# EAGLE schematic hump (EAGLE 6.1)

## Sheet 1 of 2
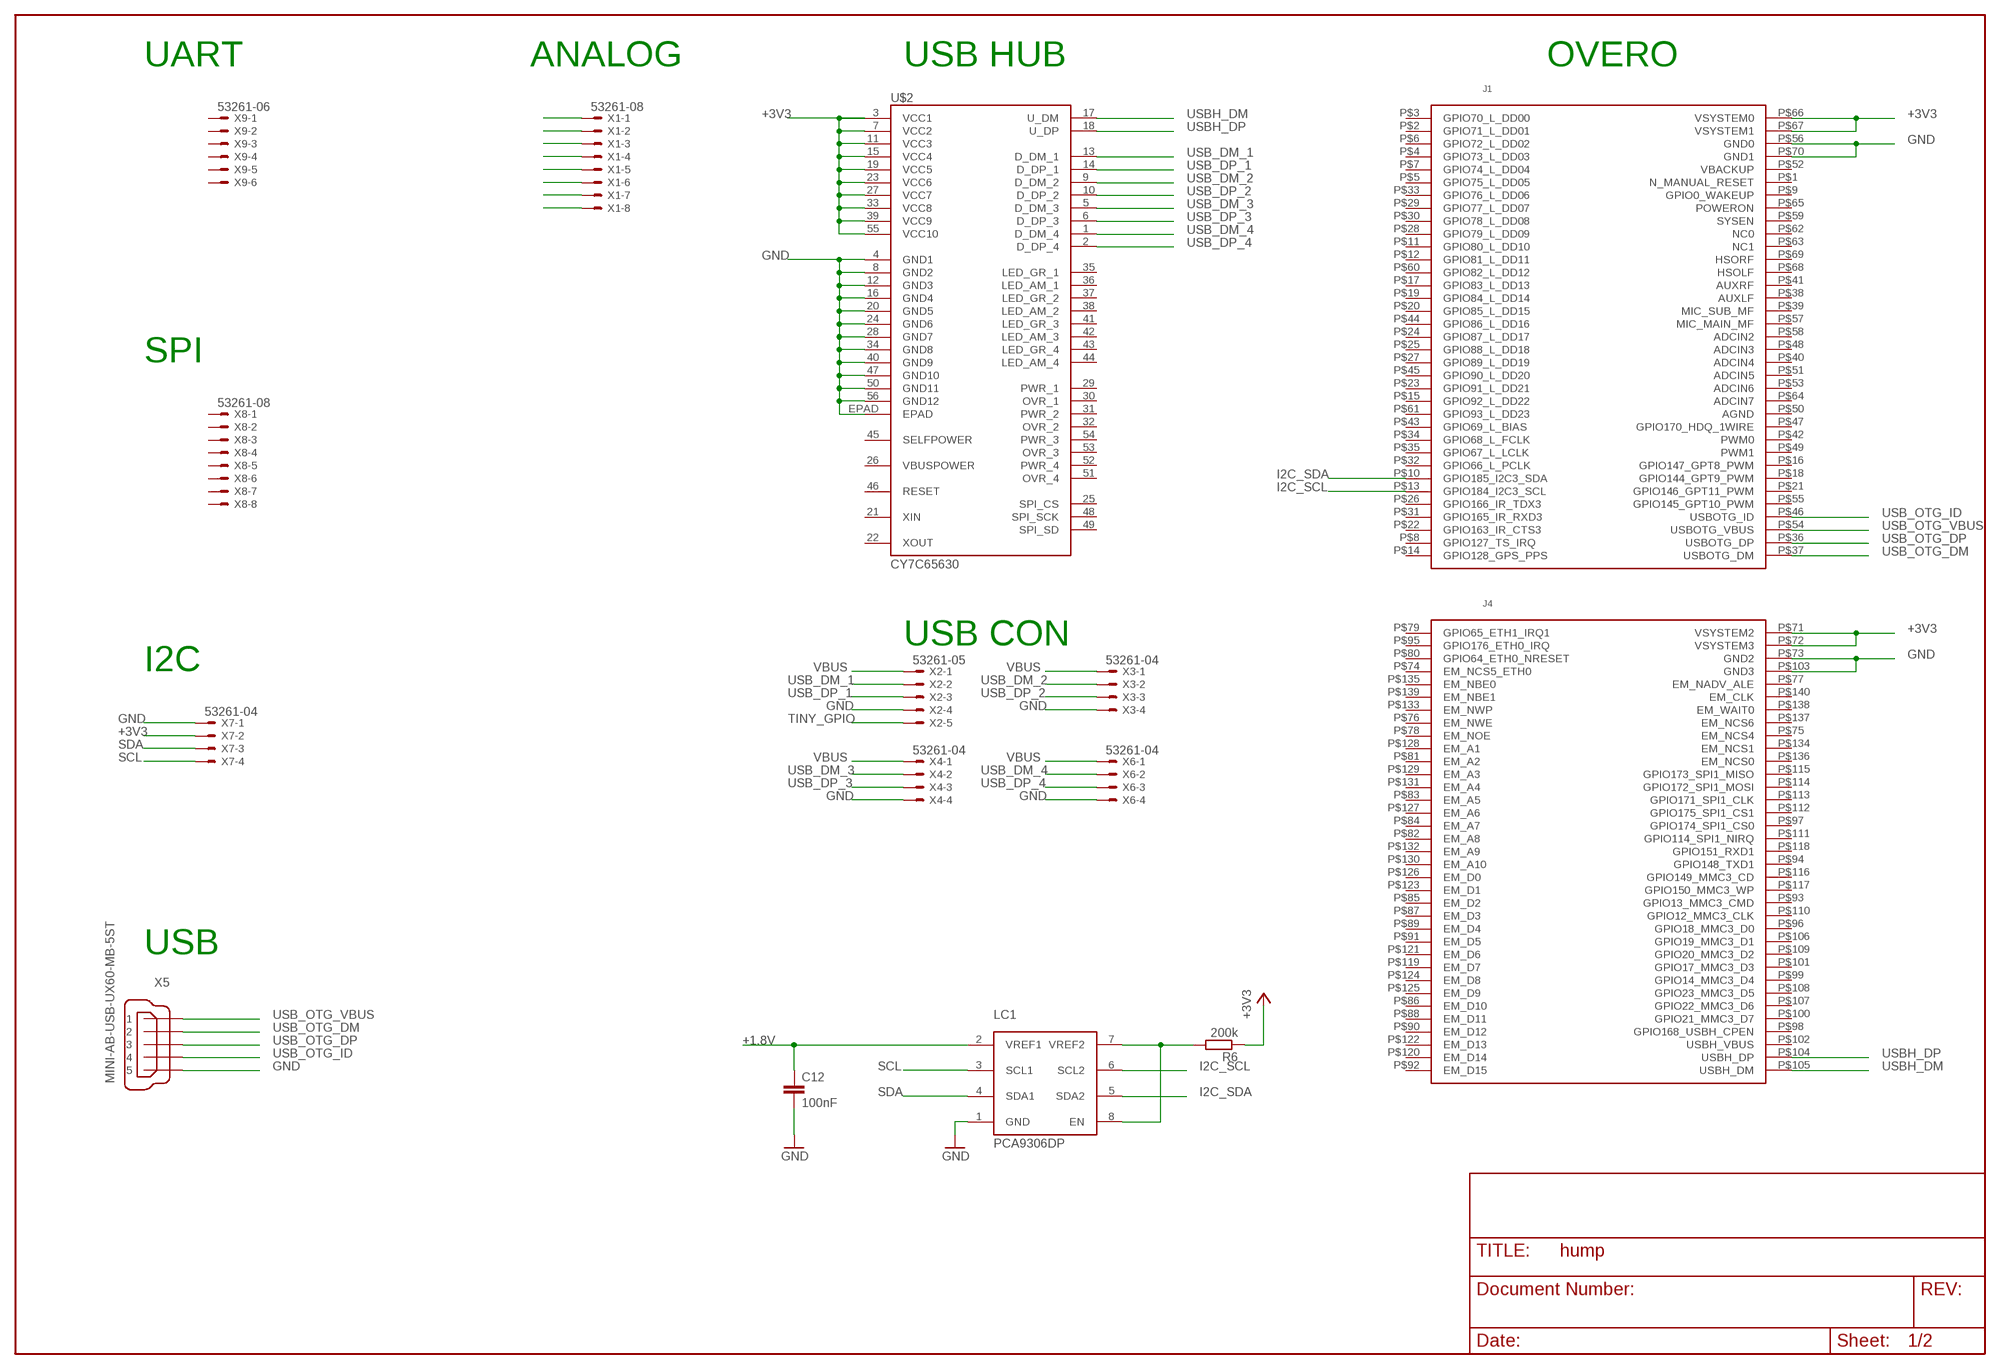
[diagram p0: schematic, sheet 1]

### Parts
C12  100nF  C-EUC0603  [C0603]
LC1  PCA9306DP  [TSSOP_B3]
R6  200k  R-EU_R0603  [R0603]
U$1  CON_OVERO  [CON_OVERO]
U$2  CY7C65630  [QFN56]
X1  53261-08  [53261-08]
X2  53261-05  [53261-05]
X3  53261-04  [53261-04]
X4  53261-04  [53261-04]
X5  MINI-AB-USB-UX60-MB-5ST  MINI-USB-UX60-MB-5ST  [UX60-MB-5ST]
X6  53261-04  [53261-04]
X7  53261-04  [53261-04]
X8  53261-08  [53261-08]
X9  53261-06  [53261-06]

### Nets
+1.8V: C12.1 LC1.2(VREF1)
+3V3: R6.1 U$1.P$66(VSYSTEM0) U$1.P$67(VSYSTEM1) U$1.P$71(VSYSTEM2) U$1.P$72(VSYSTEM3) U$2.3(VCC1) U$2.7(VCC2) U$2.11(VCC3) U$2.15(VCC4) U$2.19(VCC5) U$2.23(VCC6) U$2.27(VCC7) U$2.33(VCC8) U$2.39(VCC9) U$2.55(VCC10) X7.2
GND: C12.2 LC1.1(GND) U$1.P$56(GND0) U$1.P$70(GND1) U$1.P$73(GND2) U$1.P$103(GND3) U$2.4(GND1) U$2.8(GND2) U$2.12(GND3) U$2.16(GND4) U$2.20(GND5) U$2.24(GND6) U$2.28(GND7) U$2.34(GND8) U$2.40(GND9) U$2.47(GND10) U$2.50(GND11) U$2.56(GND12) U$2.EPAD X1.1 X2.4 X3.4 X4.4 X5.5 X6.4 X7.1 ; also sheet 2
I2C_SCL: LC1.6(SCL2) U$1.P$13(GPIO184_I2C3_SCL)
I2C_SDA: LC1.5(SDA2) U$1.P$10(GPIO185_I2C3_SDA)
N$2: X1.2
N$3: X1.3
N$4: X1.4
N$5: X1.5
N$6: X1.6
N$7: X1.7
N$8: X1.8
N$11: LC1.7(VREF2) LC1.8(EN) R6.2
SCL: LC1.3(SCL1) X7.4
SDA: LC1.4(SDA1) X7.3
TINY_GPIO: X2.5
USB_DM_1: U$2.13(D_DM_1) X2.2
USB_DM_2: U$2.9(D_DM_2) X3.2
USB_DM_3: U$2.5(D_DM_3) X4.2
USB_DM_4: U$2.1(D_DM_4) X6.2
USB_DP_1: U$2.14(D_DP_1) X2.3
USB_DP_2: U$2.10(D_DP_2) X3.3
USB_DP_3: U$2.6(D_DP_3) X4.3
USB_DP_4: U$2.2(D_DP_4) X6.3
USB_OTG_DM: U$1.P$37(USBOTG_DM) X5.2
USB_OTG_DP: U$1.P$36(USBOTG_DP) X5.3
USB_OTG_ID: U$1.P$46(USBOTG_ID) X5.4
USB_OTG_VBUS: U$1.P$54(USBOTG_VBUS) X5.1
USBH_DM: U$1.P$105(USBH_DM) U$2.17(U_DM)
USBH_DP: U$1.P$104(USBH_DP) U$2.18(U_DP)
VBUS: X2.1 X3.1 X4.1 X6.1
Unconnected: U$1.P$1(N_MANUAL_RESET) U$1.P$2(GPIO71_L_DD01) U$1.P$3(GPIO70_L_DD00) U$1.P$4(GPIO73_L_DD03) U$1.P$5(GPIO75_L_DD05) U$1.P$6(GPIO72_L_DD02) U$1.P$7(GPIO74_L_DD04) U$1.P$8(GPIO127_TS_IRQ) U$1.P$9(GPIO0_WAKEUP) U$1.P$11(GPIO80_L_DD10) U$1.P$12(GPIO81_L_DD11) U$1.P$14(GPIO128_GPS_PPS) U$1.P$15(GPIO92_L_DD22) U$1.P$16(GPIO147_GPT8_PWM) U$1.P$17(GPIO83_L_DD13) U$1.P$18(GPIO144_GPT9_PWM) U$1.P$19(GPIO84_L_DD14) U$1.P$20(GPIO85_L_DD15) U$1.P$21(GPIO146_GPT11_PWM) U$1.P$22(GPIO163_IR_CTS3) U$1.P$23(GPIO91_L_DD21) U$1.P$24(GPIO87_L_DD17) U$1.P$25(GPIO88_L_DD18) U$1.P$26(GPIO166_IR_TDX3) U$1.P$27(GPIO89_L_DD19) U$1.P$28(GPIO79_L_DD09) U$1.P$29(GPIO77_L_DD07) U$1.P$30(GPIO78_L_DD08) U$1.P$31(GPIO165_IR_RXD3) U$1.P$32(GPIO66_L_PCLK) U$1.P$33(GPIO76_L_DD06) U$1.P$34(GPIO68_L_FCLK) U$1.P$35(GPIO67_L_LCLK) U$1.P$38(AUXLF) U$1.P$39(MIC_SUB_MF) U$1.P$40(ADCIN4) U$1.P$41(AUXRF) U$1.P$42(PWM0) U$1.P$43(GPIO69_L_BIAS) U$1.P$44(GPIO86_L_DD16) U$1.P$45(GPIO90_L_DD20) U$1.P$47(GPIO170_HDQ_1WIRE) U$1.P$48(ADCIN3) U$1.P$49(PWM1) U$1.P$50(AGND) U$1.P$51(ADCIN5) U$1.P$52(VBACKUP) U$1.P$53(ADCIN6) U$1.P$55(GPIO145_GPT10_PWM) U$1.P$57(MIC_MAIN_MF) U$1.P$58(ADCIN2) U$1.P$59(SYSEN) U$1.P$60(GPIO82_L_DD12) U$1.P$61(GPIO93_L_DD23) U$1.P$62(NC0) U$1.P$63(NC1) U$1.P$64(ADCIN7) U$1.P$65(POWERON) U$1.P$68(HSOLF) U$1.P$69(HSORF) U$1.P$74(EM_NCS5_ETH0) U$1.P$75(EM_NCS4) U$1.P$76(EM_NWE) U$1.P$77(EM_NADV_ALE) U$1.P$78(EM_NOE) U$1.P$79(GPIO65_ETH1_IRQ1) U$1.P$80(GPIO64_ETH0_NRESET) U$1.P$81(EM_A2) U$1.P$82(EM_A8) U$1.P$83(EM_A5) U$1.P$84(EM_A7) U$1.P$85(EM_D2) U$1.P$86(EM_D10) U$1.P$87(EM_D3) U$1.P$88(EM_D11) U$1.P$89(EM_D4) U$1.P$90(EM_D12) U$1.P$91(EM_D5) U$1.P$92(EM_D15) U$1.P$93(GPIO13_MMC3_CMD) U$1.P$94(GPIO148_TXD1) U$1.P$95(GPIO176_ETH0_IRQ) U$1.P$96(GPIO18_MMC3_D0) U$1.P$97(GPIO174_SPI1_CS0) U$1.P$98(GPIO168_USBH_CPEN) U$1.P$99(GPIO14_MMC3_D4) U$1.P$100(GPIO21_MMC3_D7) U$1.P$101(GPIO17_MMC3_D3) U$1.P$102(USBH_VBUS) U$1.P$106(GPIO19_MMC3_D1) U$1.P$107(GPIO22_MMC3_D6) U$1.P$108(GPIO23_MMC3_D5) U$1.P$109(GPIO20_MMC3_D2) U$1.P$110(GPIO12_MMC3_CLK) U$1.P$111(GPIO114_SPI1_NIRQ) U$1.P$112(GPIO175_SPI1_CS1) U$1.P$113(GPIO171_SPI1_CLK) U$1.P$114(GPIO172_SPI1_MOSI) U$1.P$115(GPIO173_SPI1_MISO) U$1.P$116(GPIO149_MMC3_CD) U$1.P$117(GPIO150_MMC3_WP) U$1.P$118(GPIO151_RXD1) U$1.P$119(EM_D7) U$1.P$120(EM_D14) U$1.P$121(EM_D6) U$1.P$122(EM_D13) U$1.P$123(EM_D1) U$1.P$124(EM_D8) U$1.P$125(EM_D9) U$1.P$126(EM_D0) U$1.P$127(EM_A6) U$1.P$128(EM_A1) U$1.P$129(EM_A3) U$1.P$130(EM_A10) U$1.P$131(EM_A4) U$1.P$132(EM_A9) U$1.P$133(EM_NWP) U$1.P$134(EM_NCS1) U$1.P$135(EM_NBE0) U$1.P$136(EM_NCS0) U$1.P$137(EM_NCS6) U$1.P$138(EM_WAIT0) U$1.P$139(EM_NBE1) U$1.P$140(EM_CLK) U$2.21(XIN) U$2.22(XOUT) U$2.25(SPI_CS) U$2.26(VBUSPOWER) U$2.29(PWR_1) U$2.30(OVR_1) U$2.31(PWR_2) U$2.32(OVR_2) U$2.35(LED_GR_1) U$2.36(LED_AM_1) U$2.37(LED_GR_2) U$2.38(LED_AM_2) U$2.41(LED_GR_3) U$2.42(LED_AM_3) U$2.43(LED_GR_4) U$2.44(LED_AM_4) U$2.45(SELFPOWER) U$2.46(RESET) U$2.48(SPI_SCK) U$2.49(SPI_SD) U$2.51(OVR_4) U$2.52(PWR_4) U$2.53(OVR_3) U$2.54(PWR_3) X8.1 X8.2 X8.3 X8.4 X8.5 X8.6 X8.7 X8.8 X9.1 X9.2 X9.3 X9.4 X9.5 X9.6

### Notes on the sheet
- UART | ANALOG | USB HUB | OVERO
- SPI
- USB CON
- I2C
- USB

## Sheet 2 of 2
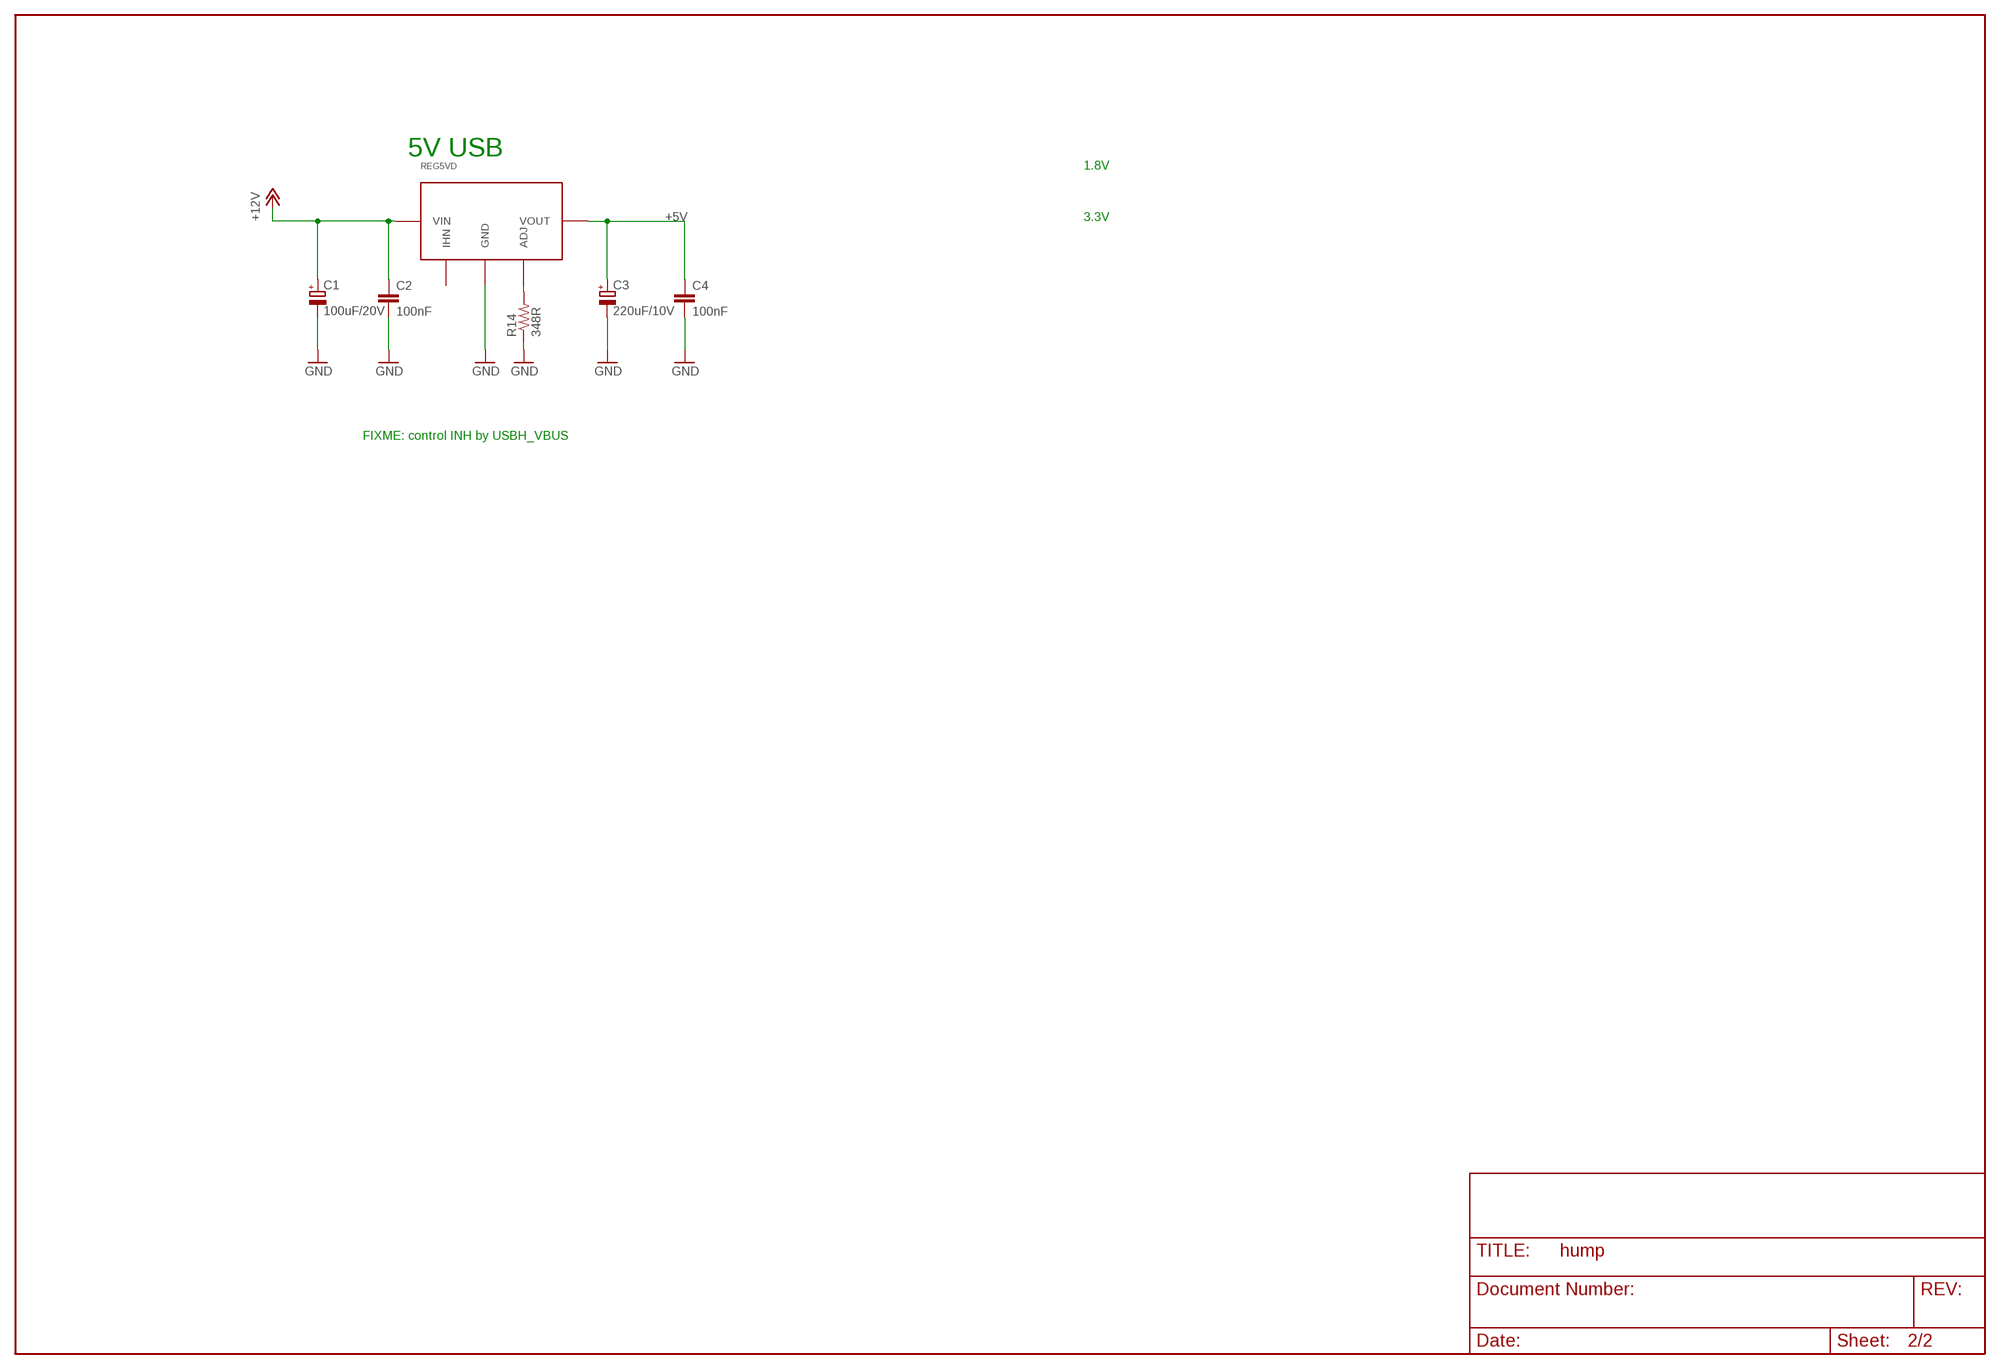
[diagram p1: schematic, sheet 2]

### Parts
C1  100uF/20V  CPOL-EUSMCD  [SMC_D]
C2  100nF  C-EUC0603  [C0603]
C3  220uF/10V  CPOL-EUSMCD  [SMC_D]
C4  100nF  C-EUC0603  [C0603]
R14  348R  R-US_R0603  [R0603]
REG5VD  PTHTH  [PTH_TH]

### Nets
+5V: C3.+ C4.1 REG5VD.P$3(VOUT)
+12V: C1.+ C2.1 REG5VD.P$1(VIN)
GND: C1.- C2.2 C3.- C4.2 R14.1 REG5VD.P$2(GND) ; also sheet 1
N$1: R14.2 REG5VD.P$4(ADJ)
Unconnected: REG5VD.P$5(IHN)

### Notes on the sheet
- 5V USB
- 1.8V
- 3.3V
- FIXME: control INH by USBH_VBUS

## Library data of the parts
C1 C3 = rcl:CPOL-EU: POLARIZED CAPACITOR, European symbol
C2 C4 C12 = rcl:C-EU: CAPACITOR, European symbol
LC1 = booz:PCA9306: Dual bidirectional I2C-bus and SMBus voltage-level translator
R6 = rcl:R-EU_: RESISTOR, European symbol
R14 = rcl:R-US_: RESISTOR, American symbol
REG5VD = paparazzi:PTH
U$1 = paparazzi:CON_OVERO
U$2 = paparazzi:CY7C65630
X1 X8 = con-molex:53?-08: CONNECTOR wire to board 1.25 mm (.049 inch) pitch header
X2 = con-molex:53?-05: CONNECTOR wire to board 1.25 mm (.049 inch) pitch header
X3 X4 X6 X7 = con-molex:53?-04: CONNECTOR wire to board 1.25 mm (.049 inch) pitch header
X5 = con-hirose:MINI-USB-: MINI USB Connector Source: http://www.hirose.co.jp/cataloge_hp/e24000019.pdf
X9 = con-molex:53?-06: CONNECTOR wire to board 1.25 mm (.049 inch) pitch header